# EAGLE board GPSDOCXO_STMv2 (EAGLE 9.6.2), part 1 of 3
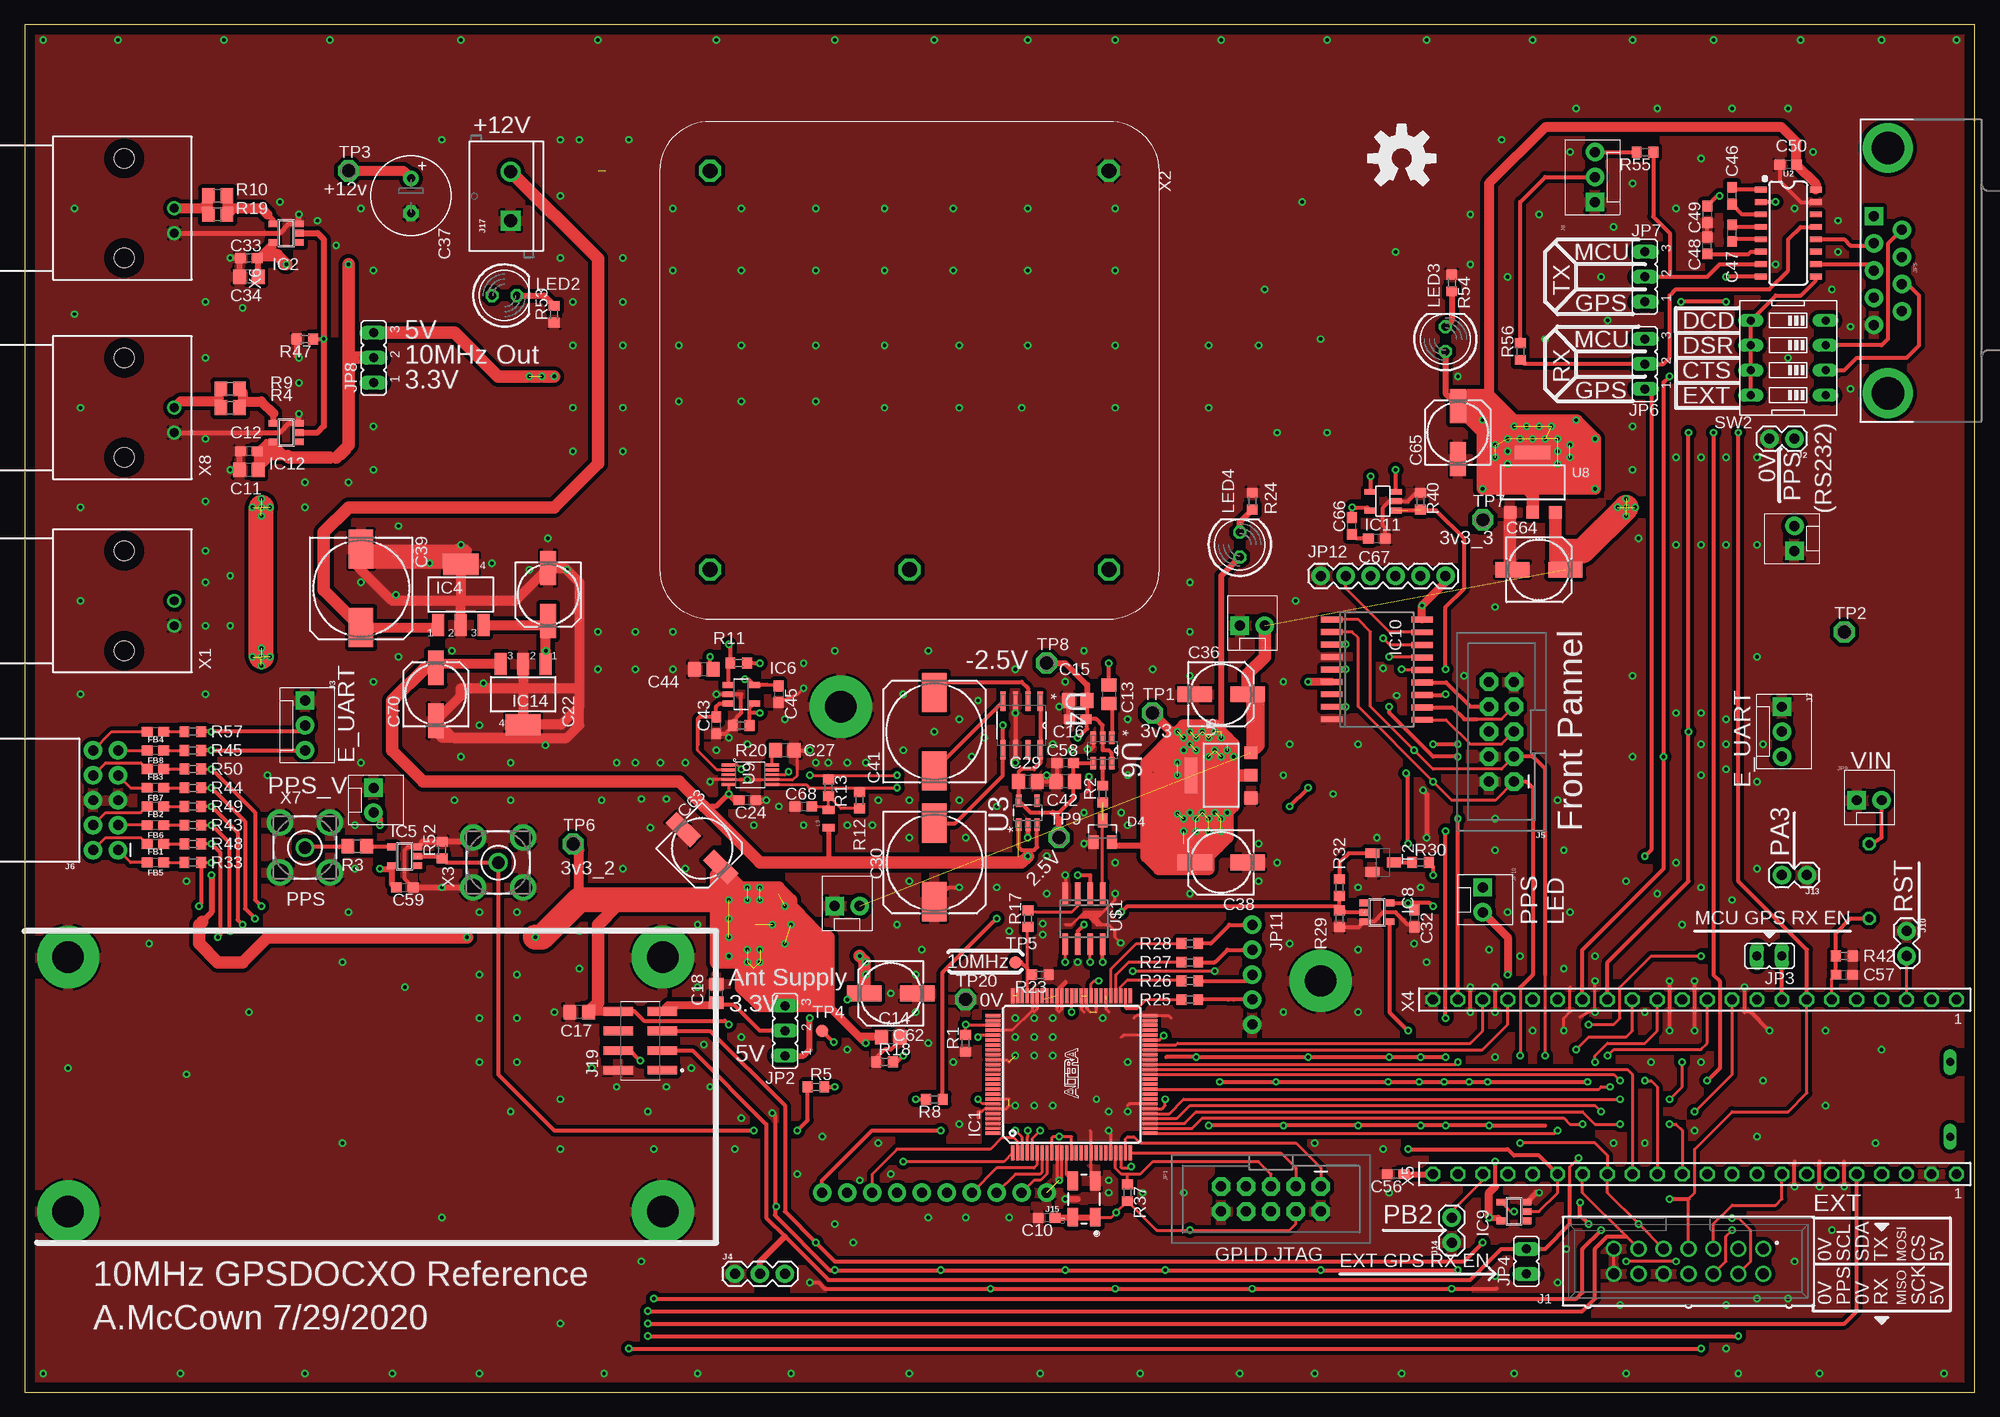
[diagram p2: board, top side]
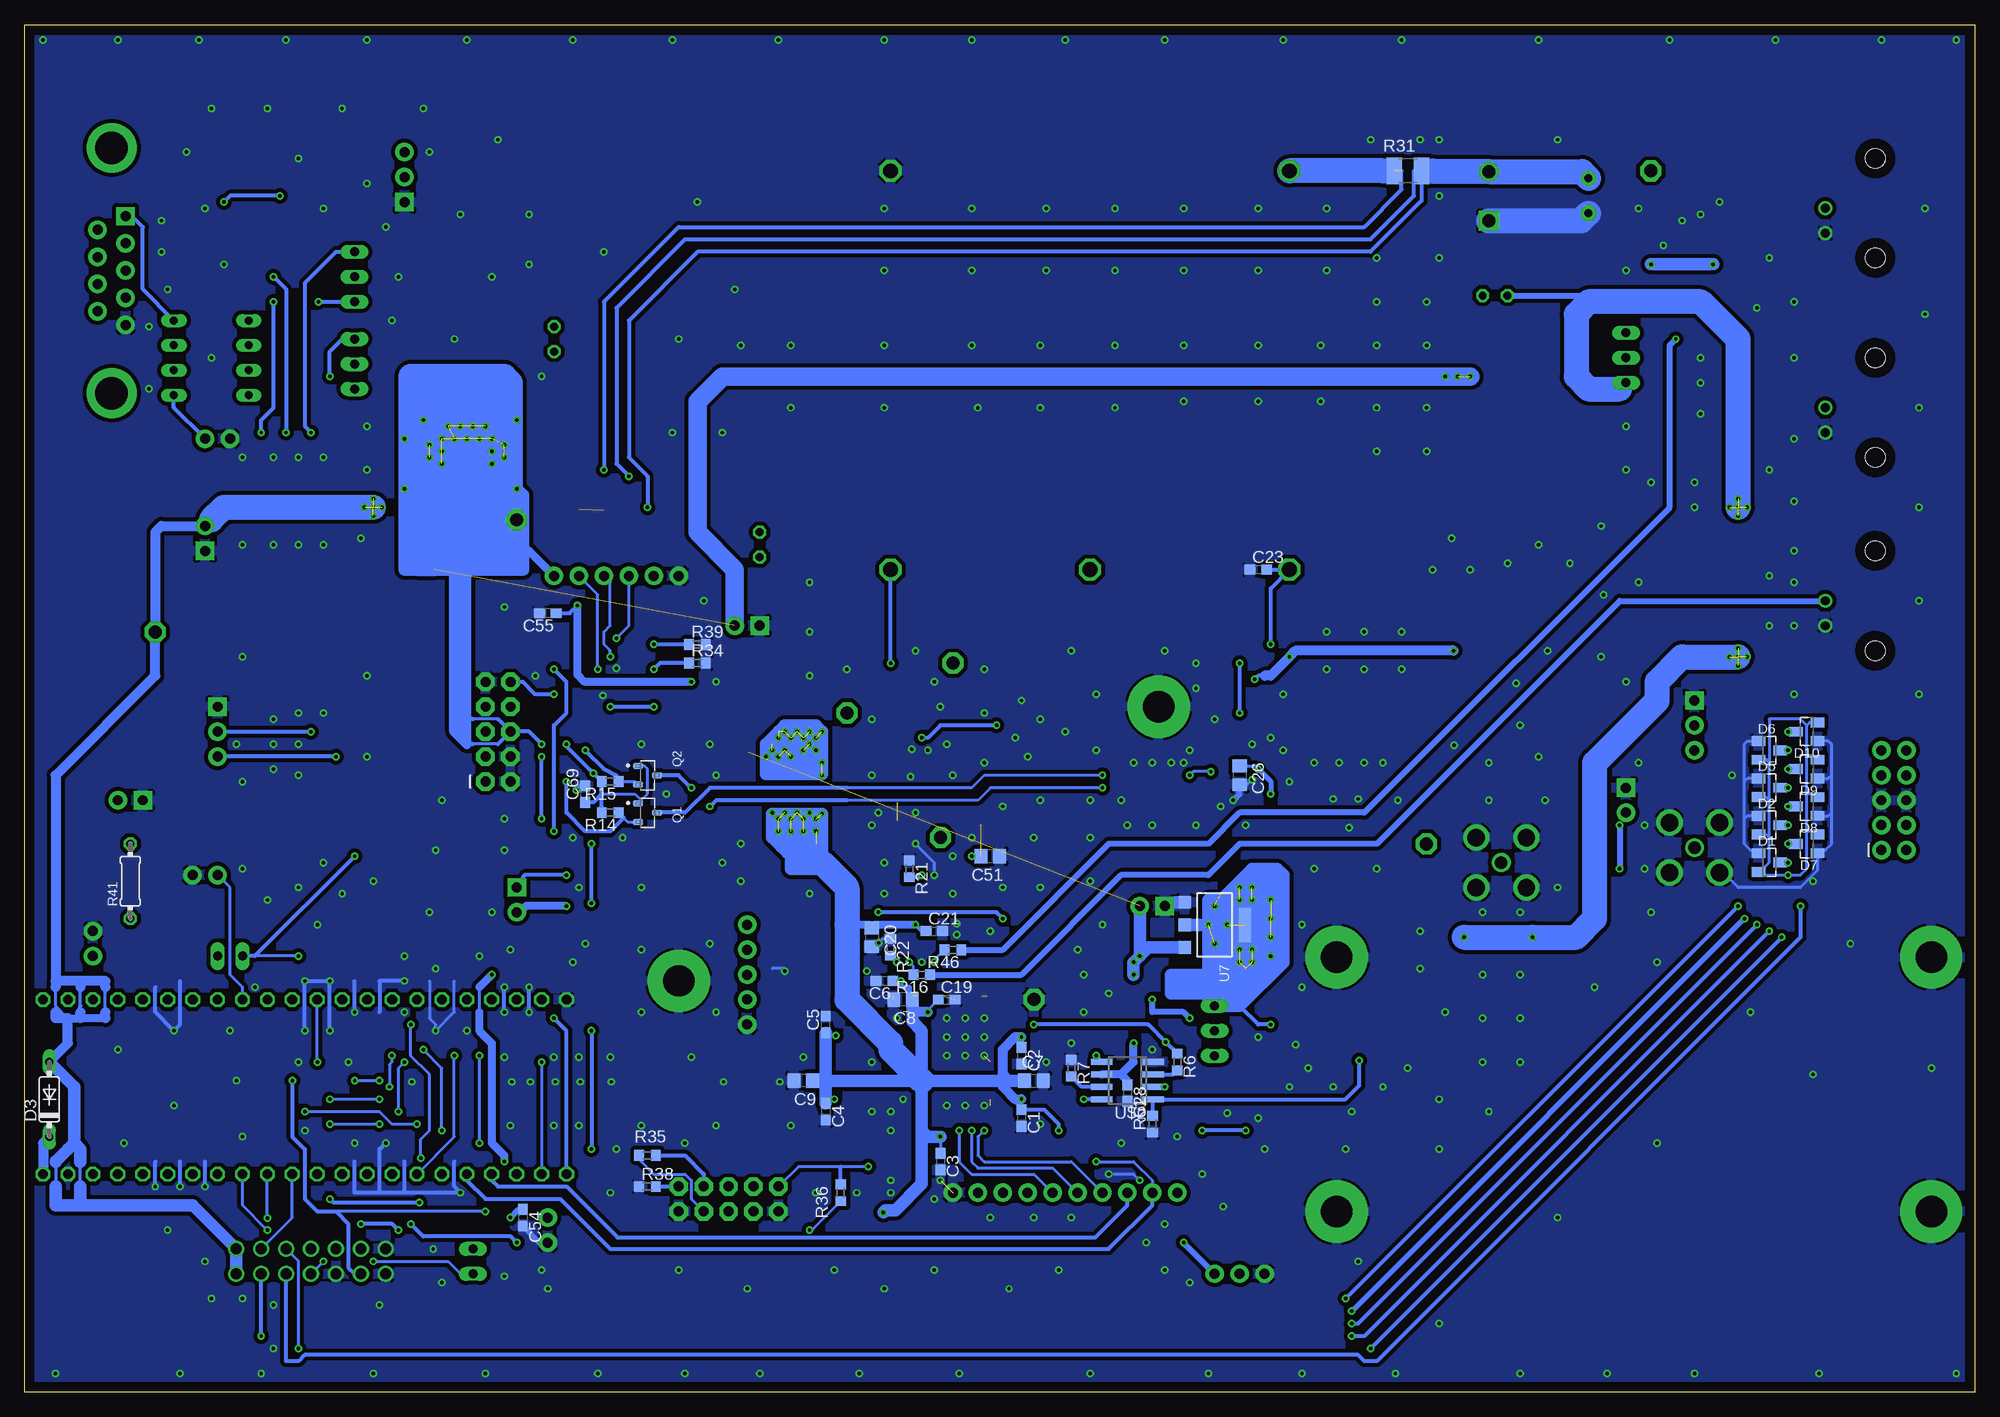
[diagram p3: board, bottom side, seen from below]

Size 198.74 x 139.37 mm. Coordinates in mm from the lower left corner, seen from the top.
Outline: 0,0 198.74,0 198.74,139.37 0,139.37 0,0
Copper layers (1*16): Top 0.035mm / dielectric 1.5mm / Bottom 0.035mm
Design rules "default": minimum track width 6mil, minimum drill 0.35mm, track to track 6mil, track to pad 6mil, pad to pad 6mil, via to via 6mil, smd to smd 6mil, copper to edge 40mil, drill to drill 6mil, minimum pad ring 10mil, minimum via ring 8mil, stop-mask expansion 4mil, vias tented up to drill 0mil, thermal gap 10mil

## Footprints (pad centres in the part's own frame; a part is rotated, then mirrored left to right if it is on the bottom)
C0603 = smd 1.1 x 1: 1 -0.85,0; 2 0.85,0
C0805 = smd 1.3 x 1.5: 1 -0.95,0; 2 0.95,0
153CLV-0605 = smd 3.5 x 1.6: + 2.7,0; - -2.7,0
153CLV-1010 = smd 4 x 2.5: + 4,0; - -4,0
E3,5-8 = drill 0.813 pad 1.6: + -1.778,0 | drill 0.813 pad 1.6 octagon: - 1.778,0
SOT23 = smd 1 x 1.4: 1 -0.95,-1.1; 2 0.95,-1.1; 3 0,1.1
DO35-7 = drill 0.813 long: A 3.81,0; C -3.81,0
0603 = smd 1.1 x 1: 1 -0.85,0; 2 0.85,0
TQFP100 = smd 1.5 x 0.35: 1 -8,6; 2 -8,5.5; 3 -8,5; 4 -8,4.5; 5 -8,4; 6 -8,3.5; 7 -8,3; 8 -8,2.5; 9 -8,2; 10 -8,1.5; 11 -8,1; 12 -8,0.5; 13 -8,0; 14 -8,-0.5; 15 -8,-1; 16 -8,-1.5; 17 -8,-2; 18 -8,-2.5; 19 -8,-3; 20 -8,-3.5; 21 -8,-4; 22 -8,-4.5; 23 -8,-5; 24 -8,-5.5; 25 -8,-6; 51 8,-6; 52 8,-5.5; 53 8,-5; 54 8,-4.5; 55 8,-4; 56 8,-3.5; 57 8,-3; 58 8,-2.5; 59 8,-2; 60 8,-1.5; 61 8,-1; 62 8,-0.5; 63 8,0; 64 8,0.5; 65 8,1; 66 8,1.5; 67 8,2; 68 8,2.5; 69 8,3; 70 8,3.5; 71 8,4; 72 8,4.5; 73 8,5; 74 8,5.5; 75 8,6 | smd 0.35 x 1.5: 26 -6,-8; 27 -5.5,-8; 28 -5,-8; 29 -4.5,-8; 30 -4,-8; 31 -3.5,-8; 32 -3,-8; 33 -2.5,-8; 34 -2,-8; 35 -1.5,-8; 36 -1,-8; 37 -0.5,-8; 38 0,-8; 39 0.5,-8; 40 1,-8; 41 1.5,-8; 42 2,-8; 43 2.5,-8; 44 3,-8; 45 3.5,-8; 46 4,-8; 47 4.5,-8; 48 5,-8; 49 5.5,-8; 50 6,-8; 76 6,8; 77 5.5,8; 78 5,8; 79 4.5,8; 80 4,8; 81 3.5,8; 82 3,8; 83 2.5,8; 84 2,8; 85 1.5,8; 86 1,8; 87 0.5,8; 88 0,8; 89 -0.5,8; 90 -1,8; 91 -1.5,8; 92 -2,8; 93 -2.5,8; 94 -3,8; 95 -3.5,8; 96 -4,8; 97 -4.5,8; 98 -5,8; 99 -5.5,8; 100 -6,8
SOT23-5 = smd 0.69 x 0.99: 1 -0.95,-1.29; 2 0,-1.29; 3 0.95,-1.29; 4 0.95,1.3; 5 -0.95,1.3
SOT223 = smd 1.219 x 2.235: 1 -2.311,-3.099; 2 0,-3.099; 3 2.311,-3.099 | smd 3.6 x 2.2: 4 0,3.099
SOT23-5' = smd 0.6 x 1.2: 1 -0.95,-1.306; 2 0,-1.306; 3 0.95,-1.306; 4 0.95,1.306; 5 -0.95,1.306
SO18W = smd 0.6 x 2.2: 1 -4.445,-4.6; 2 -3.175,-4.6; 3 -1.905,-4.6; 4 -0.635,-4.6; 5 0.635,-4.6; 6 1.905,-4.6; 7 3.175,-4.6; 8 4.445,-4.6; 9 5.715,-4.6; 10 5.775,4.6; 11 4.505,4.6; 12 3.235,4.6; 13 1.965,4.6; 14 0.695,4.6; 15 -0.575,4.6; 16 -1.845,4.6; 17 -3.145,4.6; 18 -4.445,4.6
61201421621 = drill 1.1: 1 -7.62,-1.27; 2 -7.62,1.27; 3 -5.08,-1.27; 4 -5.08,1.27; 5 -2.54,-1.27; 6 -2.54,1.27; 7 0,-1.27; 8 0,1.27; 9 2.54,-1.27; 10 2.54,1.27; 11 5.08,-1.27; 12 5.08,1.27; 13 7.62,-1.27; 14 7.62,1.27
1X02 = drill 1.016 pad 1.88: 1 0,0; 2 2.54,0
MOLEX-1X3 = drill 1.016 pad 1.88 square: 1 0,0 | drill 1.016 pad 1.88: 2 2.54,0; 3 5.08,0
1X03 = drill 1.016 pad 1.88: 1 0,0; 2 2.54,0; 3 5.08,0
2X5-SHROUDED-NS = drill 1.016 pad 1.88 octagon: 1 -1.27,5.08; 2 1.27,5.08; 3 -1.27,2.54; 4 1.27,2.54; 5 -1.27,0; 6 1.27,0; 7 -1.27,-2.54; 8 1.27,-2.54; 9 -1.27,-5.08; 10 1.27,-5.08
2X5-RAF = drill 1.016 pad 1.88: 1 -1.27,5.08; 2 1.27,5.08; 3 -1.27,2.54; 4 1.27,2.54; 5 -1.27,0; 6 1.27,0; 7 -1.27,-2.54; 8 1.27,-2.54; 9 -1.27,-5.08; 10 1.27,-5.08
1X10_NO_SILK = drill 1.016 pad 1.88: 1 0,0; 2 2.54,0; 3 5.08,0; 4 7.62,0; 5 10.16,0; 6 12.7,0; 7 15.24,0; 8 17.78,0; 9 20.32,0; 10 22.86,0
SCREWTERMINAL-5MM-2 = drill 1.3 pad 2.032 square: 1 0,0 | drill 1.3 pad 2.032: 2 5,0
621008245821 = smd 0.89 x 3: 1 -3,-2.25; 2 -3,2.25; 3 -1,-2.25; 4 -1,2.25; 5 1,-2.25; 6 1,2.25; 7 3,-2.25; 8 3,2.25
JP2 = drill 0.914 long: 1 -2.54,0; 2 0,0; 3 2.54,0
JP1 = drill 0.914 long: 1 0,-1.27; 2 0,1.27
DB9 = drill 1.016 pad 1.88 square: 1 -5.54,-1.42 | drill 1.016 pad 1.88: 2 -2.77,-1.42; 3 0,-1.42; 4 2.77,-1.42; 5 5.54,-1.42; 6 -4.15,1.42; 7 -1.38,1.42; 8 1.38,1.42; 9 4.15,1.42 | drill 3.302 pad 5.08: G1 -12.5,0; G2 12.5,0
MOLEX-1X2 = drill 1.016 pad 1.88 square: 1 0,0 | drill 1.016 pad 1.88: 2 2.54,0
1X05_NO_SILK = drill 1.016 pad 1.88: 1 0,0; 2 2.54,0; 3 5.08,0; 4 7.62,0; 5 10.16,0
1X06 = drill 1.016 pad 1.88: 1 0,0; 2 2.54,0; 3 5.08,0; 4 7.62,0; 5 10.16,0; 6 12.7,0
0805 = smd 0.8 x 1.2: 1 -0.9,0; 2 0.9,0
LED5MM = drill 0.813 octagon: A -1.27,0; K 1.27,0
SOT23-3 = smd 0.62 x 1.1: 1 -0.95,-0.975; 2 0.95,-0.975; 3 0,0.975
R0603 = smd 1 x 1.1: 1 -0.85,0; 2 0.85,0
R0805 = smd 1.3 x 1.5: 1 -0.95,0; 2 0.95,0
R1210 = smd 1.6 x 2.7: 1 -1.4,0; 2 1.4,0
0204/7 = drill 0.813 octagon: 1 -3.81,0; 2 3.81,0
STANDOFF-ELECTRICAL = drill 3.2 pad 6.35: P1 0,0
EDG-04 = drill 0.813 long: 1 -3.81,-3.81; 2 -1.27,-3.81; 3 1.27,-3.81; 4 3.81,-3.81; 5 3.81,3.81; 6 1.27,3.81; 7 -1.27,3.81; 8 -3.81,3.81
SOT23-BEC = smd 1 x 1.4: B -0.95,-1.1; C 0,1.1; E 0.95,-1.1
P1-13 = drill 1.321 pad 2.159 octagon: TP 0,0
TP13R = smd 1.3 x 1.3: TP 0,0
CRYSTAL-OSC-SMD-5X3 = smd 1.9 x 1.1: 1 -1.85,-1.15; 2 1.85,-1.15; 3 1.85,1.15; 4 -1.85,1.15
SO16 = smd 0.6 x 1.2: 1 -4.445,-2.8; 2 -3.175,-2.8; 3 -1.905,-2.8; 4 -0.635,-2.8; 5 0.635,-2.8; 6 1.905,-2.8; 7 3.175,-2.8; 8 4.445,-2.8; 9 4.445,2.8; 10 3.175,2.8; 11 1.905,2.8; 12 0.635,2.8; 13 -0.635,2.8; 14 -1.905,2.8; 15 -3.175,2.8; 16 -4.445,2.8
SOT95P284X119-5N = smd 1.27 x 0.533: 1 -1.219,0.94; 2 -1.219,0; 3 -1.219,-0.94; 4 1.219,-0.94; 5 1.219,0.94
SOIC127P600X175-8N = smd 1.981 x 0.533: 1 -2.464,1.905; 2 -2.464,0.635; 3 -2.464,-0.635; 4 -2.464,-1.905; 5 2.464,-1.905; 6 2.464,-0.635; 7 2.464,0.635; 8 2.464,1.905
SOT223' = smd 1.3 x 1.3: 1 -2.3,-3.05; 2 0,-3.05; 3 2.3,-3.05 | smd 3.6 x 1.3: 4 0,3.05
SOT95P280X145-6N = smd 1.27 x 0.559: 1 -1.295,0.94; 2 -1.295,0; 3 -1.295,-0.94; 4 1.295,-0.94; 5 1.295,0; 6 1.295,0.94
VSSOP-10 = smd 1.45 x 0.3: 1 -1.905,1.06; 2 -1.905,0.56; 3 -1.905,0.06; 4 -1.905,-0.44; 5 -1.905,-0.94; 6 2.495,-0.94; 7 2.495,-0.44; 8 2.495,0.06; 9 2.495,0.56; 10 2.495,1.06
SOIC-8 = smd 0.6 x 2.2: 1 -1.905,-2.6; 2 -0.635,-2.6; 3 0.635,-2.6; 4 1.905,-2.6; 5 1.905,2.6; 6 0.635,2.6; 7 -0.635,2.6; 8 -1.905,2.6
AMP_227161 = drill 0.9 pad 1.27: 1 0,-5.08; 2 -2.54,-5.08 | hole 2: -5.08,0; 5.08,0
MV89 = drill 1.5 octagon: 1 -20.32,-20.32; 3 -20.32,20.32; 4 20.32,-20.32; 5 20.32,0; 6 20.32,20.32
BU-SMA-V = drill 1.27: 1 0,0 | drill 1.778: 2 -2.55,2.55; 3 2.55,2.55; 4 2.55,-2.55; 5 -2.55,-2.55
TSW-122-XX-G-S = drill 1 pad 1.5 octagon: 1 26.67,0; 2 24.13,0; 3 21.59,0; 4 19.05,0; 5 16.51,0; 6 13.97,0; 7 11.43,0; 8 8.89,0; 9 6.35,0; 10 3.81,0; 11 1.27,0; 12 -1.27,0; 13 -3.81,0; 14 -6.35,0; 15 -8.89,0; 16 -11.43,0; 17 -13.97,0; 18 -16.51,0; 19 -19.05,0; 20 -21.59,0; 21 -24.13,0; 22 -26.67,0

## Placement (x,y rotation side)
C1  [C0603]  97.16,27.94 270 bottom
C2  [C0603]  97.16,34.29 270 bottom
C3  [C0603]  105.41,23.5 270 bottom
C4  [C0603]  117.09,28.57 270 bottom
C5  [C0603]  117.09,37.47 90 bottom
C6  [C0603]  111.12,41.91 180 bottom
C7  4.7u  [C0805]  95.89,31.75 0 bottom
C8  4.7u  [C0805]  109.22,40.01 180 bottom
C9  4.7u  [C0805]  119.38,31.75 180 bottom
C10  [C0603]  104.14,17.78 180 top
C11  4.7u  [C0805]  22.86,93.98 180 top
C12  [C0603]  22.86,95.89 180 top
C13  10n  [C0805]  110.49,71.12 270 top
C14  4.7u  [C0805]  88.27,36.2 0 top
C15  4.7u  [C0805]  107.31,70.48 180 top
C16  [C0603]  107.31,68.58 180 top
C17  [C0805]  56.52,38.73 180 top
C18  [C0805]  70.48,40.64 90 top
C19  [C0603]  104.78,40.01 0 bottom
C20  4.7u  [C0805]  112.39,46.35 270 bottom
C21  [C0603]  106.05,46.99 0 bottom
C22  220u  [153CLV-0605]  53.34,81.28 270 top
C23  [C0603]  73.03,83.82 0 bottom
C24  [C0603]  73.66,60.33 180 top
C26  4.7u  [C0805]  74.93,62.87 270 bottom
C27  10u  [C0805]  77.47,65.41 180 top
C28  [C0603]  86.36,30.48 270 bottom
C29  4.7u  [C0805]  102.23,62.23 0 top
C30  220u  [153CLV-1010]  92.71,53.98 270 top
C32  [C0603]  141.6,48.26 270 top
C33  [C0603]  22.86,115.57 180 top
C34  4.7u  [C0805]  22.86,113.67 180 top
C36  220u 10v  [153CLV-0605]  121.92,71.12 0 top
C37  [E3,5-8]  39.37,121.92 270 top
C38  220u 10v  [153CLV-0605]  121.92,53.98 180 top
C39  220u  [153CLV-1010]  34.29,81.92 270 top
C41  220u  [153CLV-1010]  92.71,67.31 90 top
C42  4.7u  [C0805]  106.05,62.23 180 top
C43  [C0603]  70.48,67.94 90 top
C44  4.7u  [C0805]  69.22,73.66 180 top
C45  [C0603]  76.83,71.12 270 top
C46  0.1u  [C0603]  173.99,121.92 90 top
C47  0.1u  [C0603]  173.99,118.11 90 top
C48  1u  [C0603]  171.45,116.84 90 top
C49  1u  [C0603]  171.45,120.02 270 top
C50  1u  [C0603]  179.71,125.09 180 top
C51  4.7u  [C0805]  100.33,54.61 180 bottom
C54  [C0603]  147.96,17.78 270 bottom
C55  [C0603]  145.41,79.38 180 bottom
C56  [C0603]  139.7,22.23 180 top
C57  [C0603]  185.42,42.55 0 top
C58  [C0603]  106.05,64.14 180 top
C59  [C0603]  38.73,51.44 0 top
C62  220u 10v  [153CLV-0605]  88.27,40.64 180 top
C63  220u 10v  [153CLV-0605]  69.03,55.43 315 top
C64  220u 10v  [153CLV-0605]  154.31,83.82 0 top
C65  220u 10v  [153CLV-0605]  146.05,97.79 90 top
C66  [C0603]  135.25,88.27 90 top
C67  [C0603]  137.79,87 0 top
C68  [C0603]  79.38,59.69 0 top
C69  [C0603]  141.6,60.96 90 bottom
C70  220u  [153CLV-0605]  41.91,71.12 90 top
D1  BAV99  [SOT23]  20.95,53.98 270 bottom
D2  BAV99  [SOT23]  20.95,57.78 270 bottom
D3  1N4148  [DO35-7]  196.22,29.84 90 bottom
D4  BAV99  [SOT23]  109.86,57.15 0 top
D5  BAV99  [SOT23]  20.95,61.59 270 bottom
D6  BAV99  [SOT23]  20.95,65.41 270 bottom
D7  BAV99  [SOT23]  17.14,55.88 90 bottom
D8  BAV99  [SOT23]  17.14,59.69 90 bottom
D9  BAV99  [SOT23]  17.14,63.5 90 bottom
D10  BAV99  [SOT23]  17.14,67.31 90 bottom
FB1  [0603]  13.34,55.88 0 top
FB2  [0603]  13.34,59.69 0 top
FB3  [0603]  13.34,63.5 0 top
FB4  [0603]  13.34,67.31 0 top
FB5  [0603]  13.34,53.98 180 top
FB6  [0603]  13.34,57.78 180 top
FB7  [0603]  13.34,61.59 180 top
FB8  [0603]  13.34,65.41 180 top
IC1  EPM240T100C4  [TQFP100]  106.68,32.38 90 top
IC2  74AHCT1G04DBV  [SOT23-5]  26.67,118.11 90 top
IC4  UA78M08  [SOT223]  44.45,81.28 0 top
IC5  74AHCT1G04DBV  [SOT23-5]  38.73,54.61 90 top
IC6  AD8677  [SOT23-5']  73.03,71.12 270 top
IC8  74AHCT1G04DBV  [SOT23-5]  137.79,48.9 270 top
IC9  74AHCT1G04DBV  [SOT23-5]  151.76,18.41 90 top
IC10  MCP23008/SO  [SO18W]  137.79,74.3 270 top
IC11  INA138  [SOT23-5']  138.43,90.81 90 top
IC12  74AHCT1G04DBV  [SOT23-5]  26.67,97.79 90 top
IC14  UA78M05  [SOT223]  50.8,71.12 180 top
J1  [61201421621]  169.54,13.34 180 top
J2  [1X02]  180.34,97.16 180 top
J3  [MOLEX-1X3]  28.57,70.48 270 top
J4  [1X03]  72.39,12.06 0 top
J5  [2X5-SHROUDED-NS]  150.5,67.31 180 top
J6  [2X5-RAF]  8.26,60.33 180 top
J7  [MOLEX-1X3]  179.07,69.85 270 top
J8  [MOLEX-1X3]  160.02,121.28 90 top
J10  [1X02]  191.77,46.99 270 top
J13  [1X02]  181.61,52.7 180 top
J14  [1X02]  145.41,15.24 90 top
J15  [1X10_NO_SILK]  104.14,20.32 180 top
J17  [SCREWTERMINAL-5MM-2]  49.53,119.38 90 top
J19  621008245821  [621008245821]  62.74,35.81 90 top
JP1  [2X5-SHROUDED-NS]  127,19.68 270 top
JP2  [JP2]  77.47,36.83 90 top
JP3  [JP1]  177.8,44.45 90 top
JP4  [JP1]  153.03,13.34 0 top
JP5  [DB9]  189.87,114.3 270 top
JP6  [JP2]  165.1,104.78 90 top
JP7  [JP2]  165.1,113.67 90 top
JP8  [JP2]  35.56,105.41 90 top
JP9  [MOLEX-1X2]  186.69,60.33 0 top
JP10  [MOLEX-1X2]  148.59,51.44 270 top
JP11  [1X05_NO_SILK]  125.09,47.62 270 top
JP12  [1X06]  132.08,83.19 0 top
JP13  [MOLEX-1X2]  123.83,78.11 0 top
JP14  [MOLEX-1X2]  180.34,85.72 90 top
JP15  [MOLEX-1X2]  82.55,49.53 0 top
JP16  [MOLEX-1X2]  35.56,61.59 270 top
L3  3.3µH/±20%/450mA  [0805]  81.92,58.42 90 top
LED2  [LED5MM]  48.9,111.76 0 top
LED3  [LED5MM]  144.78,107.31 90 top
LED4  [LED5MM]  123.83,86.36 90 top
LOGO1  OSHW-LOGOL  [OSHW-LOGO-L]  140.34,125.73 0 top
Q1  BSS138  [SOT23-3]  135.25,59.05 270 bottom
Q2  BSS138  [SOT23-3]  135.25,62.87 270 bottom
R1  470R  [R0603]  95.89,35.56 90 top
R2  1k  [R0603]  109.86,60.96 90 top
R3  49R9  [R0805]  33.91,55.63 180 top
R4  100R  [R0805]  20.95,100.33 180 top
R5  453R  [R0603]  80.64,31.11 0 top
R6  453R  [R0603]  81.28,33.66 270 bottom
R7  806R  [R0603]  92.08,33.02 270 bottom
R8  453R  [R0603]  92.71,29.84 180 top
R9  100R  [R0805]  20.95,102.23 180 top
R10  100R  [R0805]  19.68,121.92 180 top
R11  10k  [R0603]  72.77,74.3 180 top
R12  10k  [R0603]  85.09,60.33 270 top
R13  10k  [R0603]  81.92,61.59 270 top
R14  10k  [R0603]  139.06,59.05 180 bottom
R15  10k  [R0603]  139.06,62.23 180 bottom
R16  453R  [R0603]  107.31,42.55 180 bottom
R17  453R  [R0603]  102.23,48.26 90 top
R18  806R  [R0603]  87.63,33.66 0 top
R19  100R  [R0805]  19.68,120.02 180 top
R20  10k  [R0603]  73.03,67.94 0 top
R21  806R  [R0603]  108.58,53.34 270 bottom
R22  806R  [R0603]  110.49,45.34 270 bottom
R23  470R  [R0603]  103.5,42.55 180 top
R24  [R0603]  125.09,90.81 270 top
R25  [R0603]  118.75,40.01 180 top
R26  [R0603]  118.75,41.91 180 top
R27  [R0603]  118.75,43.81 180 top
R28  [R0603]  118.75,45.72 180 top
R29  470R  [R0603]  133.99,48.26 90 top
R30  [R0603]  142.24,53.98 0 top
R31  0R01  [R1210]  57.78,124.46 0 bottom
R32  [R0603]  133.99,51.44 270 top
R33  [R0603]  17.14,53.98 180 top
R34  [R0603]  130.18,74.3 0 bottom
R35  [R0603]  135.25,24.13 180 bottom
R36  [R0603]  115.57,20.32 270 bottom
R37  [R0603]  112.39,20.32 270 top
R38  [R0603]  135.25,20.95 0 bottom
R39  [R0603]  130.18,76.2 0 bottom
R40  249k  [R0603]  142.24,90.81 270 top
R41  100k  [0204/7]  187.96,52.07 90 bottom
R42  15k  [R0603]  185.42,44.45 180 top
R43  [R0603]  17.14,57.78 180 top
R44  [R0603]  17.14,61.59 180 top
R45  [R0603]  17.14,65.41 180 top
R46  453R  [R0603]  104.14,45.09 180 bottom
R47  470R  [R0603]  28.57,107.31 180 top
R48  [R0603]  17.14,55.88 180 top
R49  [R0603]  17.14,59.69 180 top
R50  [R0603]  17.14,63.5 180 top
R51  DNP  [R0603]  83.82,27.3 90 bottom
R52  470R  [R0603]  42.55,55.24 90 top
R53  [R0603]  53.98,109.86 90 top
R54  [R0603]  145.41,113.03 270 top
R55  [R0603]  165.1,126.36 180 top
R56  [R0603]  152.4,106.05 90 top
R57  [R0603]  17.14,67.31 180 top
S1  [STANDOFF-ELECTRICAL]  83.19,69.85 0 top
S2  [STANDOFF-ELECTRICAL]  132.08,41.91 0 top
S11  [STANDOFF-ELECTRICAL]  65.02,44.32 0 top
S12  [STANDOFF-ELECTRICAL]  4.45,44.32 0 top
S13  [STANDOFF-ELECTRICAL]  65.02,18.41 0 top
S14  [STANDOFF-ELECTRICAL]  4.45,18.41 0 top
SW2  [EDG-04]  179.71,105.41 90 top
T2  3904  [SOT23-BEC]  138.43,53.98 270 top
TP1  TPPAD1-13  [P1-13]  114.94,69.22 0 top
TP2  TPPAD1-13  [P1-13]  185.42,77.47 0 top
TP3  TPPAD1-13  [P1-13]  33.02,124.46 0 top
TP4  TPTP13R  [TP13R]  81.28,36.83 0 top
TP5  TPTP13R  [TP13R]  100.97,43.81 0 top
TP6  TPPAD1-13  [P1-13]  55.88,55.88 0 top
TP7  TPPAD1-13  [P1-13]  148.59,88.9 0 top
TP8  TPPAD1-13  [P1-13]  104.14,74.3 0 top
TP9  TPPAD1-13  [P1-13]  105.41,56.52 0 top
TP20  TPPAD1-13  [P1-13]  95.89,40.01 0 top
U1  OSCILLATOR5X3-PIN1-INDICATED  [CRYSTAL-OSC-SMD-5X3]  107.95,19.68 90 top
U2  MAX3232  [SO16]  179.71,118.11 270 top
U3  LP2980AIM5-2.5  [SOT95P284X119-5N]  102.23,59.05 90 top
U4  MAX660CSA+  [SOIC127P600X175-8N]  101.6,67.94 270 top
U5  NX1117C33Z  [SOT223']  121.92,62.87 90 top
U6  TLV3501AIDBVR  [SOT95P280X145-6N]  109.86,65.41 270 top
U7  NX1117C33Z  [SOT223']  77.47,47.62 270 bottom
U8  NX1117C33Z  [SOT223']  153.67,92.71 0 top
U9  DACX0501  [VSSOP-10]  73.66,62.87 0 top
U$1  PL123-05N  [SOIC-8]  107.95,48.26 180 top
U$2  PL123-05N  [SOIC-8]  86.36,31.75 90 bottom
X1  10MHz  [AMP_227161]  10.16,80.64 90 top
X2  MV89  [MV89]  90.17,104.14 270 top
X3  PPS  [BU-SMA-V]  48.26,53.98 90 top
X4  [TSW-122-XX-G-S]  170.18,40.01 0 top
X5  [TSW-122-XX-G-S]  170.18,22.23 0 top
X6  10MHz  [AMP_227161]  10.16,120.65 90 top
X7  PPSA  [BU-SMA-V]  28.57,55.5 0 top
X8  10MHz  [AMP_227161]  10.16,100.33 90 top